# Altium schematic sheet PMU.SchDoc
size A; SheetNumber: 4; SheetTotal: 4
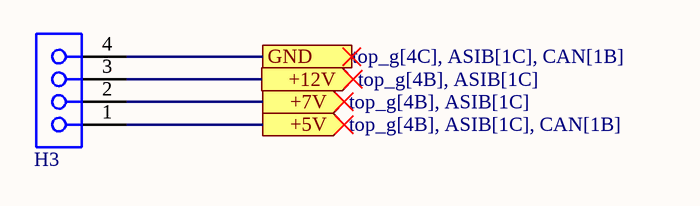
[diagram p0: PMU.SchDoc]

## Parts
H3  61300411821  [61300411821]  (value not drawn)

## Ports
+5V (out, see top_g[4B], ASIB[1C], CAN[1B]), +7V (out, see top_g[4B], ASIB[1C]), +12V (out, see top_g[4B], ASIB[1C]), GND (see top_g[4C], ASIB[1C], CAN[1B])

## Nets
+5V: H3.1 ; port +5V
+7V: H3.2 ; port +7V
+12V: H3.3 ; port +12V
GND: H3.4 ; port GND

## Library data of the parts
H3 = 61300411821: WR-PHD Socket Header, THT, Vertical, pitch 2.54mm, 1 Row, 4P; Manufacturer: Wurth Elektronik; Contact Resistance: 20mOhm; Rated Current: 3A; Working Voltage: 250V; Withstanding Voltage: 500V; Manufacturer Part Number: 61300411821; Category: Board-to-Board Connectors; Match Code: WR-PHD; ComponentLink1Description: Website Link; ComponentLink1URL: https://www.we-online.com/redexpert/article/61300411821?ad; ComponentLink2Description: Datasheet Link; ComponentLink2URL: https://www.we-online.com/redexpert/spec/61300411821?ad; Mount: Through Hole; Operating Temperature Max: 125°C; Operating Temperature Min: -40°C; Packaging: Tray; Gender: Socket Header; Number of Pins: 4; Number of Rows: 1; Orientation: Vertical; Pitch: 2.54mm